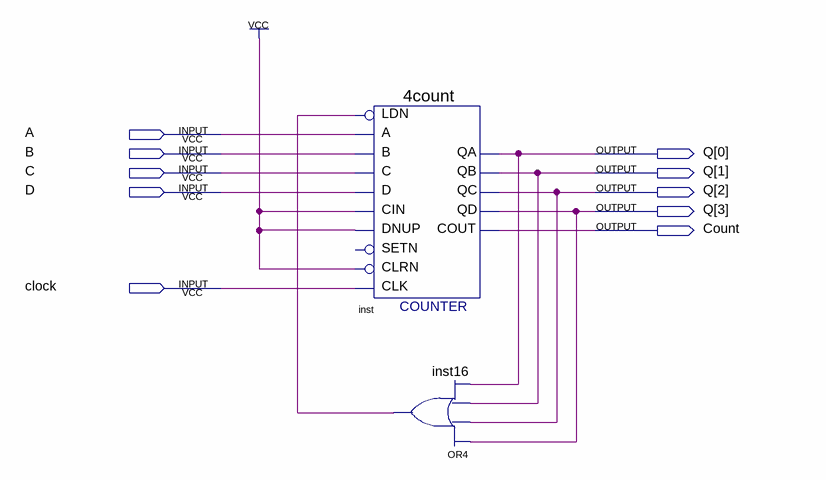
[diagram p0: schematic sheet]
// Quartus schematic counter.bdf as structural Verilog: 2 symbols, 10 pins
module counter (
  input  A,
  input  B,
  input  C,
  input  D,
  input  clock,
  output [3:0] Q,
  output Count
);

  wire inst16_out;

  \4count  inst (
    .LDN(inst16_out), .B(B), .A(A), .D(D), .CIN(1'b1), .DNUP(1'b1), .CLK(clock), .C(C), .CLRN(1'b1),
    .QA(Q[0]), .QB(Q[1]), .QC(Q[2]), .QD(Q[3]), .COUT(Count));  // open: SETN
  or inst16 (inst16_out, Q[3], Q[2], Q[1], Q[0]);
endmodule
